# Altium schematic sheet ADC_1 Board.SchDoc_jan19.SchDoc
size A; SheetNumber: 1; SheetTotal: 2; SPICEModelCachePBYFTRTB: <root> / <DocumentId>PBYFTRTB</DocumentId> / <CacheFrame Number="0"> / <Model Name="op1177" Kind="CKT"> / <Text>* OP1177 SPICE Macro-model / * Description: Amplifier / * Generic Desc: 6/30V, BIP, OP, Low Vos, Low TcVos, 1X / * Developed by: SB, ADSiV apps / * Revision History: 08/10/2012 - Updated to new header style / * 1.0 (05/2002) / * Copyright 2002, 2012 by Analog Devices, Inc. / * / * Refer to http://www.analog.com/Analog_Root/static/techSupport/designTools/spiceModels/license/spice_general.html for License Statement. Use of this model / * indicates your acceptance of the terms and provisions in the License Statement. / * / * BEGIN Notes: / * / * Not Modeled: / * / * Parameters modeled include: Vsy=±15V / * / * END Notes / * / * Node assignments / *               non-inverting input / *               | inverting input / *               | | positive supply / *               | | |  negative supply / *               | | |  |  output / *               | | |  |  | / *               | | |  |  | / .SUBCKT OP1177  1 2 99 50 34 / * / * INPUT STAGE &amp; POLE AT 100 MHZ / * / R3   5 51     6.8E3 / R4   6 51     6.8E3 / CIN  1  2     1.5E-12 / C2   5  6      3.5E-12 / I1   97 4      500E-6 / IOS  1  2     0.1E-9 / EOS  9  3     POLY(2)  (26, 28) (73, 98) 15E-6  1 1 / Q1   5  2  7  QX / Q2   6  9  8  QX / R5   7  4     50 / R6   8  4     50 / D1   2 36     DZ / D2   1 36     DZ / EN   3  1     10  0  1 / GN1  0  2     13  0  1 / GN2  0  1     16  0  1 / * / EREF 98 0     28  0  1 / EP   97 0     99  0  1 / EM   51 0     50  0  1 / * / * VOLTAGE NOISE SOURCE / * / DN1  35 10    DEN / DN2  10 11    DEN / VN1  35  0    DC 2 / VN2  0  11    DC 2 / * / * CURRENT NOISE SOURCE / * / DN3  12 13    DIN / DN4  13 14    DIN / VN3  12  0    DC 2 / VN4  0  14    DC 2 / * / * CURRENT NOISE SOURCE / * / DN5  15 16    DIN / DN6  16 17    DIN / VN5  15  0    DC 2 / VN6  0  17    DC 2 / * / * GAIN STAGE &amp; DOMINANT POLE AT 0.439 HZ / * / R7  18 98     1.45E7 / C3  18 98     25E-9 / G1  98 18     5  6  5.15E-3 / V2  97 19     1.5 / V3  20 51     1.5 / D3  18 19     DX / D4  20 18     DX / * / * POLE/ZERO PAIR AT 1.5MHz/12.7MHz / * / R8  21 98     1E3 / R9  21 22     1.25E3 / C4  22 98     10E-12 / G2  98 21     18 28  1E-3 / * / * POLE AT 2568 MHz / * / R10 23 98     1 / C5  23 98     62E-12 / G3  98 23     21 28  1 / * / * POLE AT 2568 MHz / * / R11 24 98     1 / C6  24 98     62E-12 / G4  98 24     23 28  1 / * / * POLE AT 2568 MHz / * / R14 27 98     1 / C8  27 98    62E-12 / G5  98 27     24 28  1 / * / * COMMON-MODE GAIN NETWORK WITH ZERO AT 1 kHZ / * / R12 25 26     1E6 / C7  25 26     159.155E-12 / R13 26 98     1 / E2  25 98      POLY(2) 1 98 2 98 0 0.28 0.28 / * / *PSRR=121dB / EPSY 98 72 POLY(1) (99,50) 0 1 / RPS3 72 73 1E6 / CPS3 72 73 3E-9 / RPS4 73 98 1 / * OUTPUT STAGE / * / R15 28 99     100E3 / R16 28 50     100E3 / C9  28 50     1E-6 / ISY 99 50     250E-6 / R17 29 99     100 / R18 29 50     100 / L2  29 34     1E-9 / G6  32 50     27 29  10E-3 / G7  33 50     29 27  10E-3 / G8  29 99     99 27  10E-3 / G9  50 29     27 50  10E-3 / V4  30 29     1.3 / V5  29 31     3.8 / F1  29  0     V4  1 / F2  0  29     V5  1 / D5  27 30     DX / D6  31 27     DX / D7  99 32     DX / D8  99 33     DX / D9  50 32     DY / D10 50 33     DY / * / * MODELS USED / * / .MODEL QX PNP(BF=5E5) / .MODEL DX   D(IS=1E-12) / .MODEL DY   D(IS=1E-15 BV=50) / .MODEL DZ   D(IS=1E-15 BV=7.0) / .MODEL DEN  D(IS=1E-12 RS=6.8E3 KF=1.95E-15 AF=1) / .MODEL DIN  D(IS=1E-12 RS=77.3E-6 KF=3.38E-15 AF=1) / .ENDS OP1177</Text> / </Model> / </CacheFrame> / </root>
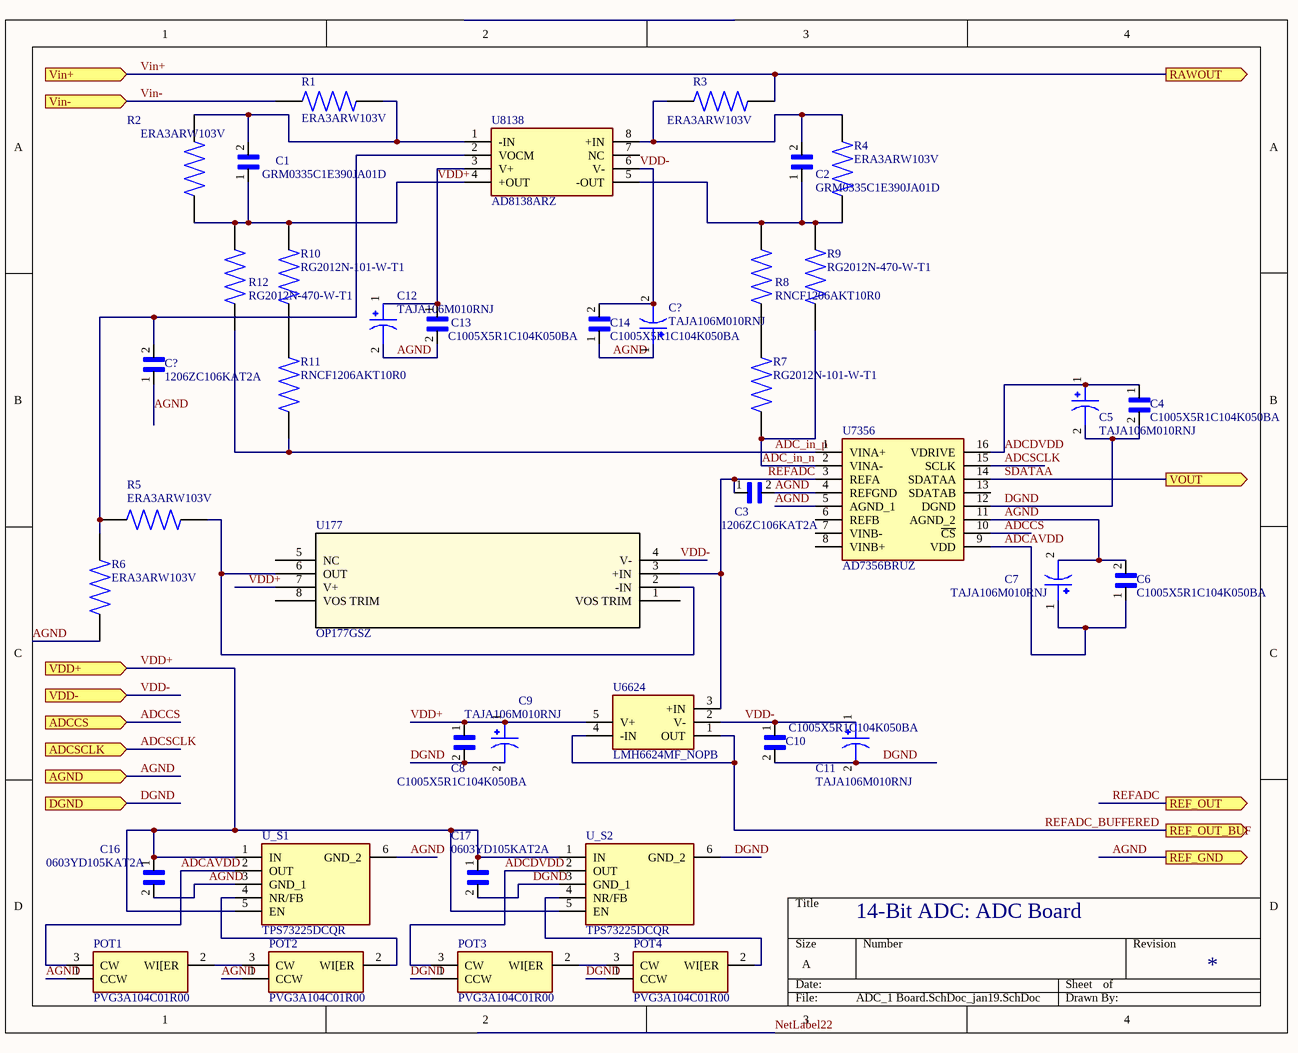
[diagram p0: ADC_1 Board.SchDoc_jan19.SchDoc]

## Parts
(Parts that share a designator on the sheet are numbered #1, #2 ... from top to bottom, then left to right.)
C1  GRM0335C1E390JA01D  [CAPC0603X33N]
C2  GRM0335C1E390JA01D  [CAPC0603X33N]
C3  1206ZC106KAT2A  [CAPC3216X178N]
C4  C1005X5R1C104K050BA  [CAPC1005X55N]
C5  TAJA106M010RNJ  [CAPMP3216X180N]
C6  C1005X5R1C104K050BA  [CAPC1005X55N]
C7  TAJA106M010RNJ  [CAPMP3216X180N]
C8  C1005X5R1C104K050BA  [CAPC1005X55N]
C9  TAJA106M010RNJ  [CAPMP3216X180N]
C10  C1005X5R1C104K050BA  [CAPC1005X55N]
C11  TAJA106M010RNJ  [CAPMP3216X180N]
C12  TAJA106M010RNJ  [CAPMP3216X180N]
C13  C1005X5R1C104K050BA  [CAPC1005X55N]
C14  C1005X5R1C104K050BA  [CAPC1005X55N]
C16  0603YD105KAT2A  [CAPC1608X90N]
C17  0603YD105KAT2A  [CAPC1608X90N]
C?#1  TAJA106M010RNJ  [CAPMP3216X180N]
C?#2  1206ZC106KAT2A  [CAPC3216X178N]
POT1  PVG3A104C01R00  [PVG3A104C01R00]
POT2  PVG3A104C01R00  [PVG3A104C01R00]
POT3  PVG3A104C01R00  [PVG3A104C01R00]
POT4  PVG3A104C01R00  [PVG3A104C01R00]
R1  ERA3ARW103V  [RES_ERA3ARW103V]
R2  ERA3ARW103V  [RES_ERA3ARW103V]
R3  ERA3ARW103V  [RES_ERA3ARW103V]
R4  ERA3ARW103V  [RES_ERA3ARW103V]
R5  ERA3ARW103V  [RES_ERA3ARW103V]
R6  ERA3ARW103V  [RES_ERA3ARW103V]
R7  RG2012N-101-W-T1  [RESC2012X50N]
R8  RNCF1206AKT10R0  [RESC3015X65N]
R9  RG2012N-470-W-T1  [RESC2012X50N]
R10  RG2012N-101-W-T1  [RESC2012X50N]
R11  RNCF1206AKT10R0  [RESC3015X65N]
R12  RG2012N-470-W-T1  [RESC2012X50N]
U177  OP177GSZ  [R_8_ADI]
U6624  LMH6624MF_NOPB  [SOT95P280X145-5N]
U7356  AD7356BRUZ  [SOP65P640X120-16N]
U8138  AD8138ARZ  [SOIC127P600X175-8N]
U_S1  TPS73225DCQR  [SOT127P706X180-6N]
U_S2  TPS73225DCQR  [SOT127P706X180-6N]

## Ports
ADCCS (in), ADCSCLK (in), AGND (in), DGND (in), RAWOUT (out), REF_GND (out), REF_OUT (out), REF_OUT_BUF (out), VDD+ (in), VDD- (in), Vin+ (in), Vin- (in), VOUT (out)

## Nets
ADC_in_n: R7.1 R9.2 U7356.2(VINA-)
ADC_in_p: R11.2 R12.2 U7356.1(VINA+)
ADCAVDD: C6.1 C7.1 POT1.3(CW) U7356.9(VDD) U_S1.2(OUT)
ADCCS: U7356.10(~{CS}) ; port ADCCS
ADCDVDD: C4.1 C5.1 POT3.3(CW) U7356.16(VDRIVE) U_S2.2(OUT)
ADCSCLK: U7356.15(SCLK) ; port ADCSCLK
AGND: C3.2 C6.2 C7.2 C12.2 C13.2 C14.1 C16.2 C?#1.1 C?#2.1 POT1.1(CCW) POT2.1(CCW) R6.2 U7356.4(REFGND) U7356.5(AGND_1) U7356.11(AGND_2) U_S1.3(GND_1) U_S1.6(GND_2) ; port AGND, port REF_GND
DGND: C4.2 C5.2 C8.2 C9.2 C10.2 C11.2 C17.2 POT3.1(CCW) POT4.1(CCW) U7356.12(DGND) U_S2.3(GND_1) U_S2.6(GND_2) ; port DGND
REFADC: C3.1 U177.3(+IN) U6624.3(+IN) U7356.3(REFA) ; port REF_OUT
REFADC_BUFFERED: U6624.1(OUT) U6624.4(-IN) ; port REF_OUT_BUF
SDATAA: U7356.14(SDATAA) ; port VOUT
VDD+: C1.1 C8.1 C9.1 C12.1 C13.1 C16.1 C17.1 R2.2 R10.1 R12.1 U177.7(V+) U6624.5(V+) U8138.3(V+) U8138.4(+OUT) U_S1.1(IN) U_S1.5(EN) U_S2.1(IN) U_S2.5(EN) ; port VDD+
VDD-: C10.1 C11.1 C14.2 C?#1.2 U177.4(V-) U6624.2(V-) U8138.6(V-) ; port VDD-
Vin+: R3.1 ; port Vin+, port RAWOUT
Vin-: R1.2 ; port Vin-
NetC1_2: C1.2 R1.1 R2.1 U8138.1(-IN)
NetC2_1: C2.1 R4.2 R8.2 R9.1 U8138.5(-OUT)
NetC2_2: C2.2 R3.2 R4.1 U8138.8(+IN)
NetC?#2_2: C?#2.2 R5.1 R6.1 U8138.2(VOCM)
NetPOT1_2: POT1.2(WI[ER) POT2.3(CW)
NetPOT2_2: POT2.2(WI[ER) U_S1.4(NR/FB)
NetPOT3_2: POT3.2(WI[ER) POT4.3(CW)
NetPOT4_2: POT4.2(WI[ER) U_S2.4(NR/FB)
NetR5_2: R5.2 U177.2(-IN) U177.6(OUT)
NetR7_2: R7.2 R8.1
NetR10_2: R10.2 R11.1

Not connected (* = marked no-connect by the designer): U177 1(VOS_TRIM) 5(NC) 8(VOS_TRIM); U7356 6(REFB) 7(VINB-) 8(VINB+) 13(SDATAB); U8138 7(NC)

## Notes on the sheet
- 14-Bit ADC: ADC Board

## Library data of the parts
C1 C2 = GRM0335C1E390JA01D: SMD Capacitor C0G(EIA) with Capacitance: 39pF Tol. 5%. Rated Voltage: 25Vdc; Package: None; Price: None; Value: *; MP: GRM0335C1E390JA01D; Availability: Unavailable
C3 C?#2 = 1206ZC106KAT2A: 10ÂµF Â±10% 10V Ceramic Capacitor X7R 1206 (3216 Metric); MF: AVX; Package: 3216 AVX; MP: 1206ZC106KAT2A; Availability: Warning; Price: None; Purchase-URL: https://pricing.snapeda.com/search/part/1206ZC106KAT2A/?ref=eda; Value: *; SnapEDA_Link: https://www.snapeda.com/parts/1206ZC106KAT2A/AVX/view-part/1765308/?ref=snap
C4 C6 C8 C10 C13 C14 = C1005X5R1C104K050BA: CERAMIC CAPACITOR, 0.1UF, 16V, X5R, 10%, 0402; Package: None; Price: None; Value: *; MP: C1005X5R1C104K050BA; Availability: Unavailable
C5 C7 C9 C11 C12 C?#1 = TAJA106M010RNJ: 10ÂµF Molded Tantalum Capacitors 10V 1206 (3216 Metric) 3Ohm; MF: AVX; MP: TAJA106M010RNJ; SnapEDA_Link: https://www.snapeda.com/parts/TAJA106M010RNJ/AVX/view-part/1681918/?ref=snap; Arrow_Electronics-Purchase-URL: https://snapeda.com/shop?store=Arrow+Electronics&id=1681918; Availability: Warning; Mouser-Purchase-URL: https://snapeda.com/shop?store=Mouser&id=1681918; Package: 1206 AVX; Value: *; Price: None
C16 C17 = 0603YD105KAT2A: 1ÂµF Â±10% 16V Ceramic Capacitor X5R 0603 (1608 Metric); MF: AVX; SnapEDA_Link: https://www.snapeda.com/parts/0603YD105KAT2A/AVX%20/%20Kyocera/view-part/270397/?ref=snap; Value: *; Availability: Unavailable; Price: None; MP: 0603YD105KAT2A; Package: 1608 AVX; DigiKey-Purchase-URL: https://snapeda.com/shop?store=DigiKey&id=270397
POT1-POT4 = PVG3A104C01R00: Variable Resistor; Manufacturer_Name: Bourns; Datasheet Link: https://componentsearchengine.com//PVG3A104C01R00.pdf; Height: 2mm; Mouser2 Part Number: 81-PVG3A104C01R00; Mouser2 Price/Stock: https://www.mouser.com/Search/Refine.aspx?Keyword=81-PVG3A104C01R00; Manufacturer_Part_Number: PVG3A104C01R00
R7 R10 = RG2012N-101-W-T1: RES SMD 100 OHM 0.05% 1/8W 0805; MF: Susumu; MP: RG2012N-101-W-T1; Value: *; Availability: Warning; Package: 2012 TE Connectivity; Purchase-URL: https://pricing.snapeda.com/search/part/RG2012N-101-W-T1/?ref=eda; SnapEDA_Link: https://www.snapeda.com/parts/RG2012N-101-W-T1/Susumu/view-part/3591849/?ref=snap; Price: None
U177 = OP177GSZ: No Description Available; Vendor: Analog Devices Inc; Built_By: EMA_UL_Team; SourceLibrary: Analog_2012-01-01_9; Manufacturer_Part_Number: OP177GSZ; Copyright: Copyright (C) 2021 Accelerated Designs. All rights reserved; RefDes: RefDes; Type: DEV
U6624 = LMH6624MF_NOPB: Integrated Circuit; Manufacturer_Name: Texas Instruments; Manufacturer_Part_Number: LMH6624MF/NOPB; Datasheet Link: http://www.ti.com/lit/ds/symlink/lmh6624.pdf; Height: 1.45mm
U7356 = AD7356BRUZ: Integrated Circuit; Manufacturer_Name: Analog Devices; Datasheet Link: http://www.analog.com/static/imported-files/data_sheets/AD7356.pdf; Height: 1.2mm; Manufacturer_Part_Number: AD7356BRUZ
U8138 = AD8138ARZ: Integrated Circuit; Manufacturer_Name: Analog Devices; Datasheet Link: https://componentsearchengine.com//AD8138ARZ.pdf; Height: 1.75mm; Mouser2 Part Number: 584-AD8138ARZ; Mouser2 Price/Stock: https://www.mouser.com/Search/Refine.aspx?Keyword=584-AD8138ARZ; Manufacturer_Part_Number: AD8138ARZ
U_S1 U_S2 = TPS73225DCQR: Integrated Circuit; Manufacturer_Name: Texas Instruments; Datasheet Link: http://www.ti.com/lit/gpn/tps732; Height: 1.8mm; Manufacturer_Part_Number: TPS73225DCQR
R1-R6 = ERA3ARW103V: MP: ERA3ARW103V; Package: None; Price: None; Availability: Unavailable; Value: *
R8 R11 = RNCF1206AKT10R0: Package: None; Price: None; Value: *; MP: RNCF1206AKT10R0; Availability: Unavailable
R9 R12 = RG2012N-470-W-T1: Package: None; Price: None; Value: *; MP: RG2012N-470-W-T1; Availability: Unavailable